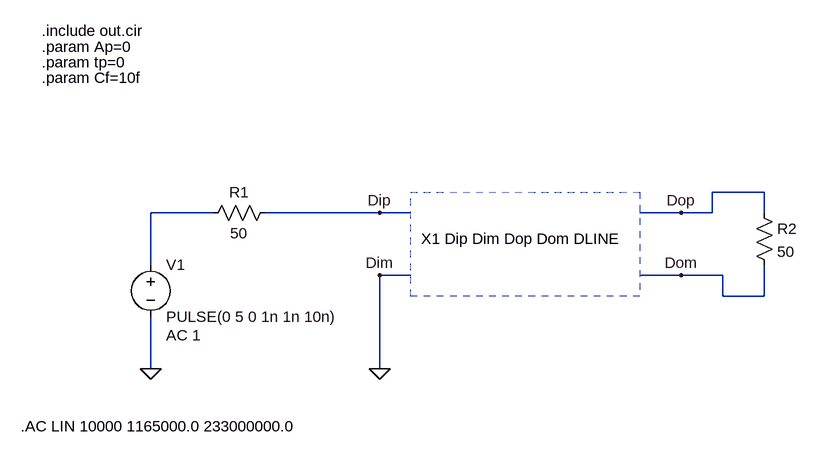
[diagram p0: schematic tb.asc]
tb.asc, the LTspice schematic file:
Version 4
SHEET 1 1368 680
WIRE 1312 192 1232 192
WIRE 464 224 368 224
WIRE 720 224 544 224
WIRE 768 224 720 224
WIRE 1184 224 1120 224
WIRE 1232 224 1232 192
WIRE 1232 224 1184 224
WIRE 1312 224 1312 192
WIRE 368 304 368 224
WIRE 768 320 720 320
WIRE 1184 320 1120 320
WIRE 1248 320 1184 320
WIRE 1248 352 1248 320
WIRE 1312 352 1312 304
WIRE 1312 352 1248 352
WIRE 368 464 368 384
WIRE 720 464 720 320
FLAG 368 464 0
FLAG 720 224 Dip
FLAG 720 464 0
FLAG 720 320 Dim
FLAG 1184 224 Dop
FLAG 1184 320 Dom
SYMBOL voltage 368 288 R0
WINDOW 123 24 124 Left 2
WINDOW 39 0 0 Left 0
SYMATTR InstName V1
SYMATTR Value PULSE(0 5 0 1n 1n 10n)
SYMATTR Value2 AC 1
SYMBOL res 560 208 R90
WINDOW 0 0 56 VBottom 2
WINDOW 3 32 56 VTop 2
SYMATTR InstName R1
SYMATTR Value 50
SYMBOL res 1296 208 R0
SYMATTR InstName R2
SYMATTR Value 50
TEXT 200 -56 Left 2 !.include out.cir
TEXT 200 -32 Left 2 !.param Ap=0
TEXT 200 -8 Left 2 !.param tp=0
TEXT 200 16 Left 2 !.param Cf=10f
TEXT 784 264 Left 2 !X1 Dip Dim Dop Dom DLINE
TEXT 168 552 Left 2 !.AC LIN 10000 1165000.0 233000000.0
RECTANGLE Normal 1120 352 768 192 2

The netlist it stands for:
* tb.asc
V1 N001 0 PULSE(0 5 0 1n 1n 10n) AC 1
R1 Dip N001 50
R2 Dop Dom 50
.include out.cir
.param Ap=0
.param tp=0
.param Cf=10f
X1 Dip Dim Dop Dom DLINE
.AC LIN 10000 1165000.0 233000000.0
.backanno
.end